# EasyEDA schematic 2 Schematic_HF Upconverter (TH).json

## Sheets
1 HF Upconverter (TH): Mixer with filters: TITLE: HF Upconverter (TH): Mixer with filters; REV: 3.5.EE; Date: 2018-03-05; Sheet: 3/3; Drawn By: IgrikXD
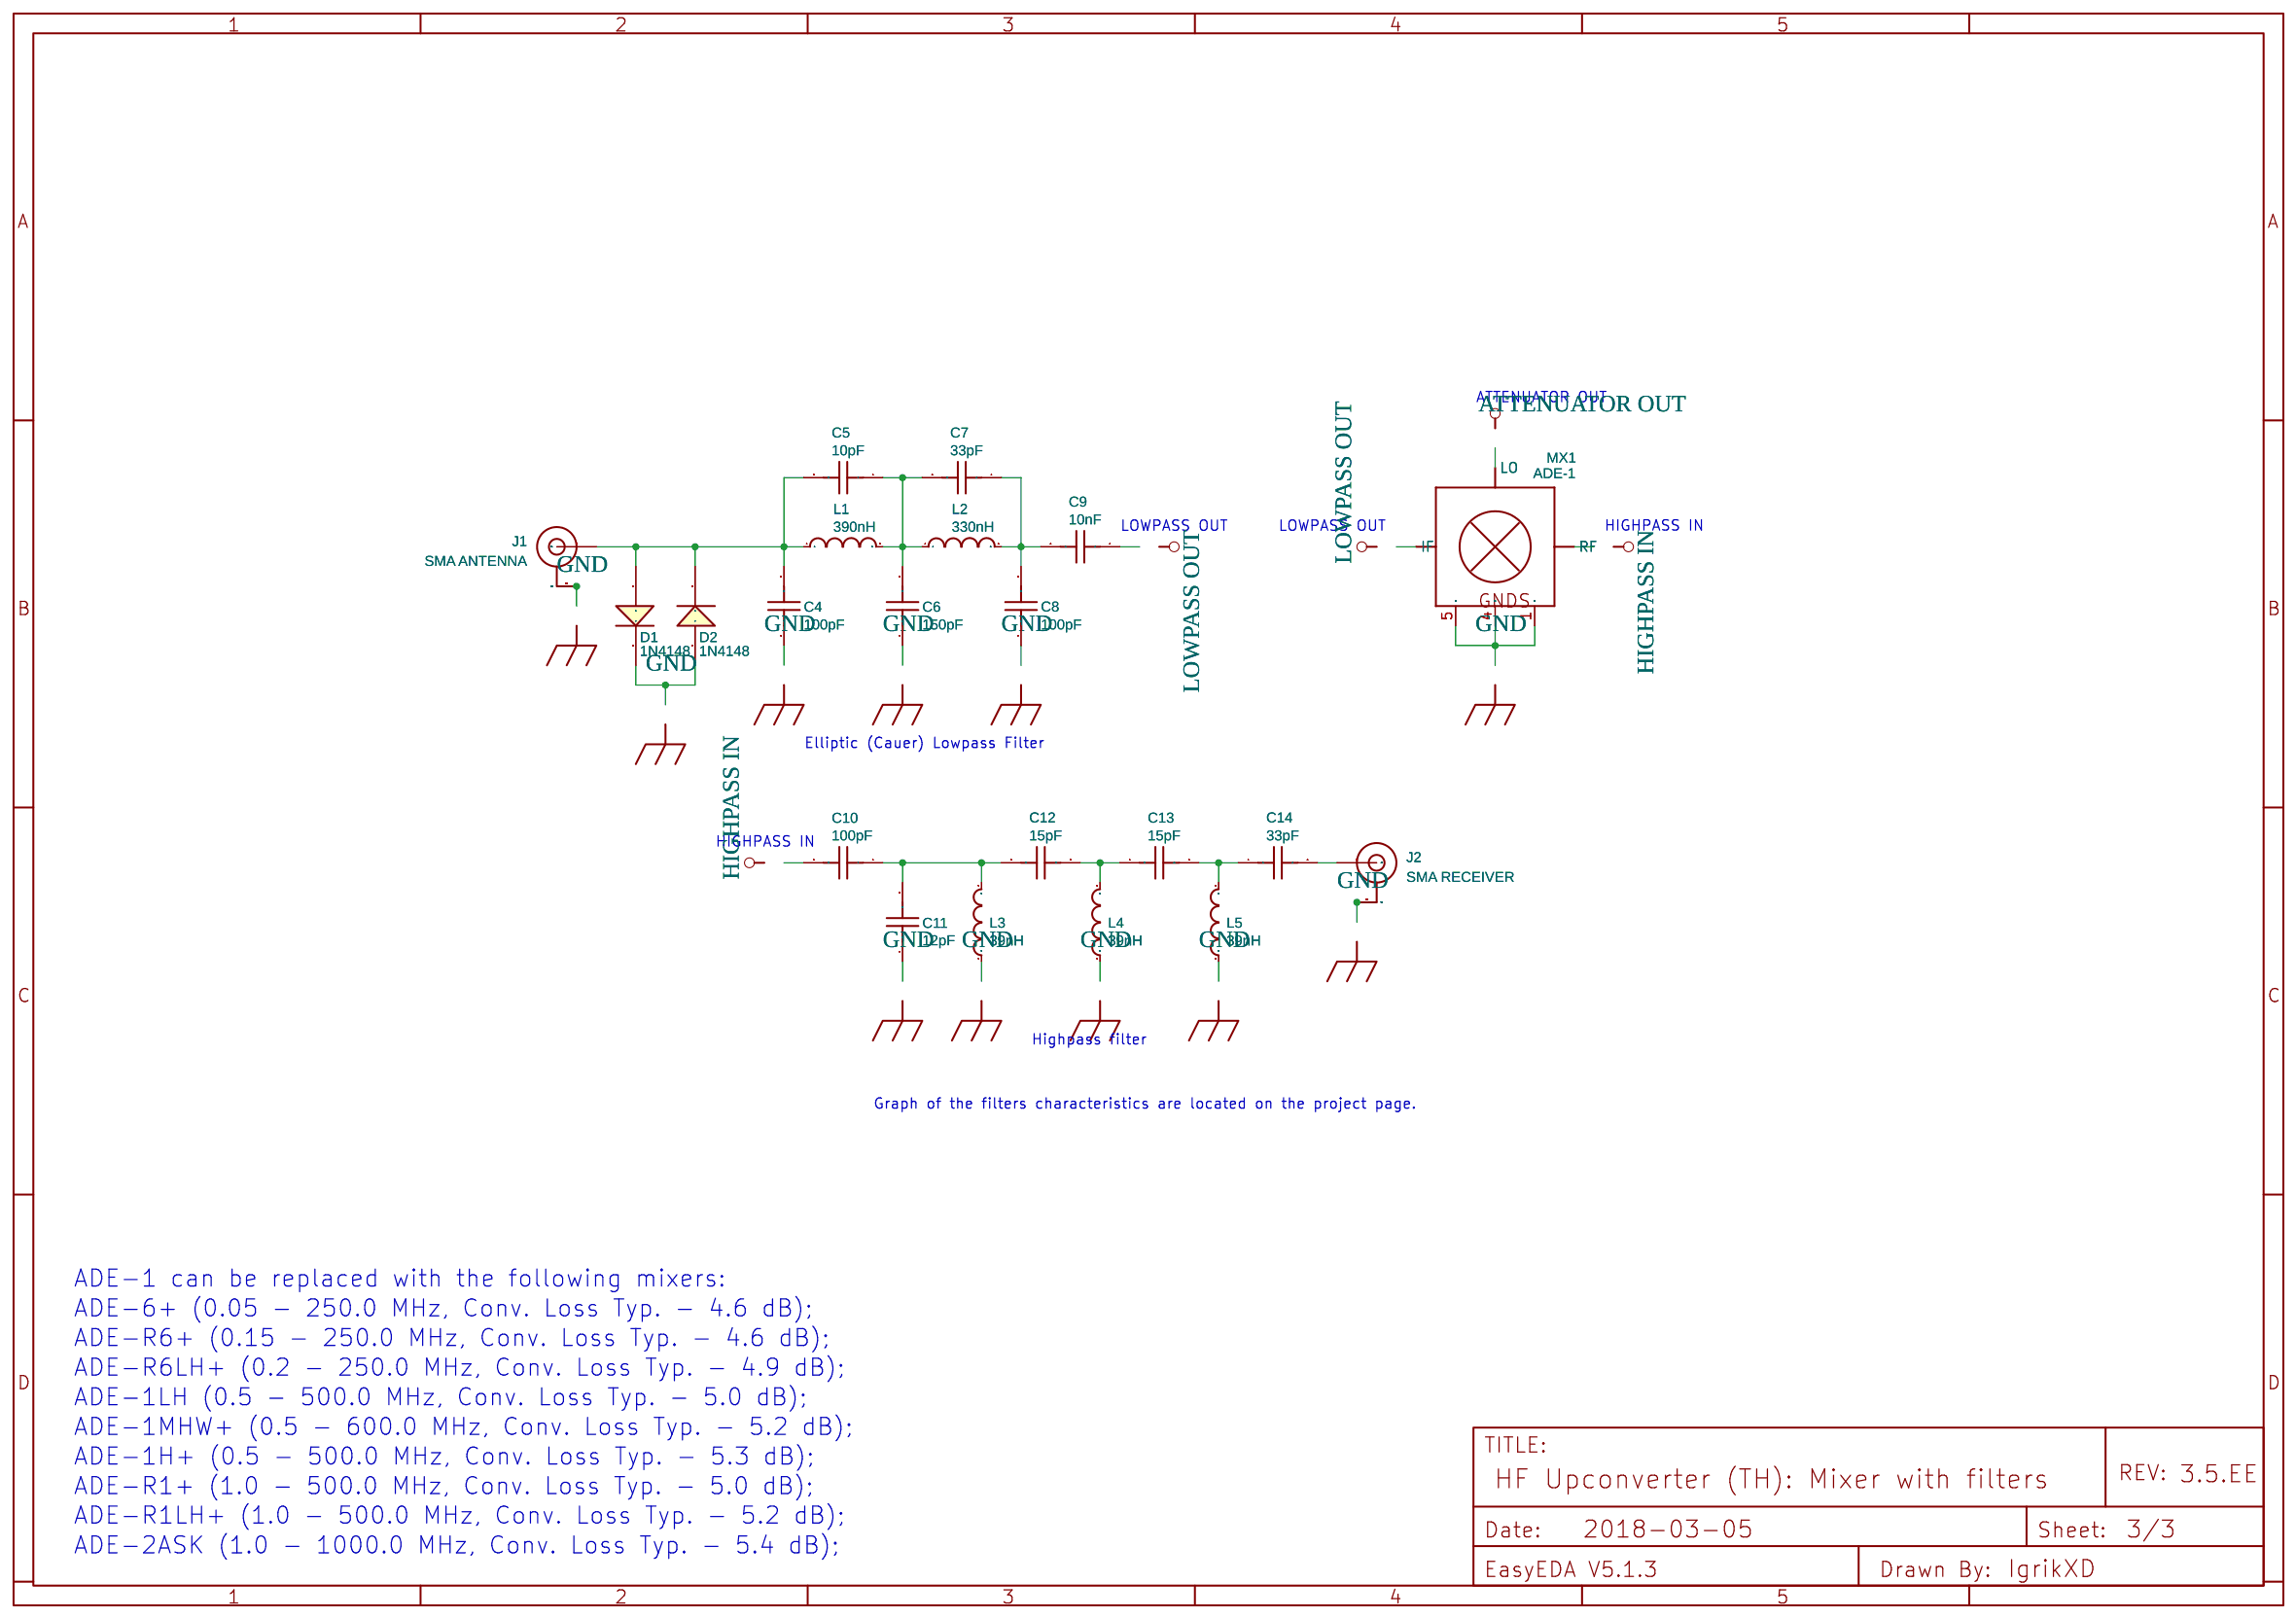
[diagram p0: HF Upconverter (TH): Mixer with filters]
2 HF Upconverter (TH): Power circuit: TITLE: HF Upconverter (TH): Power circuit; Sheet: 1/3
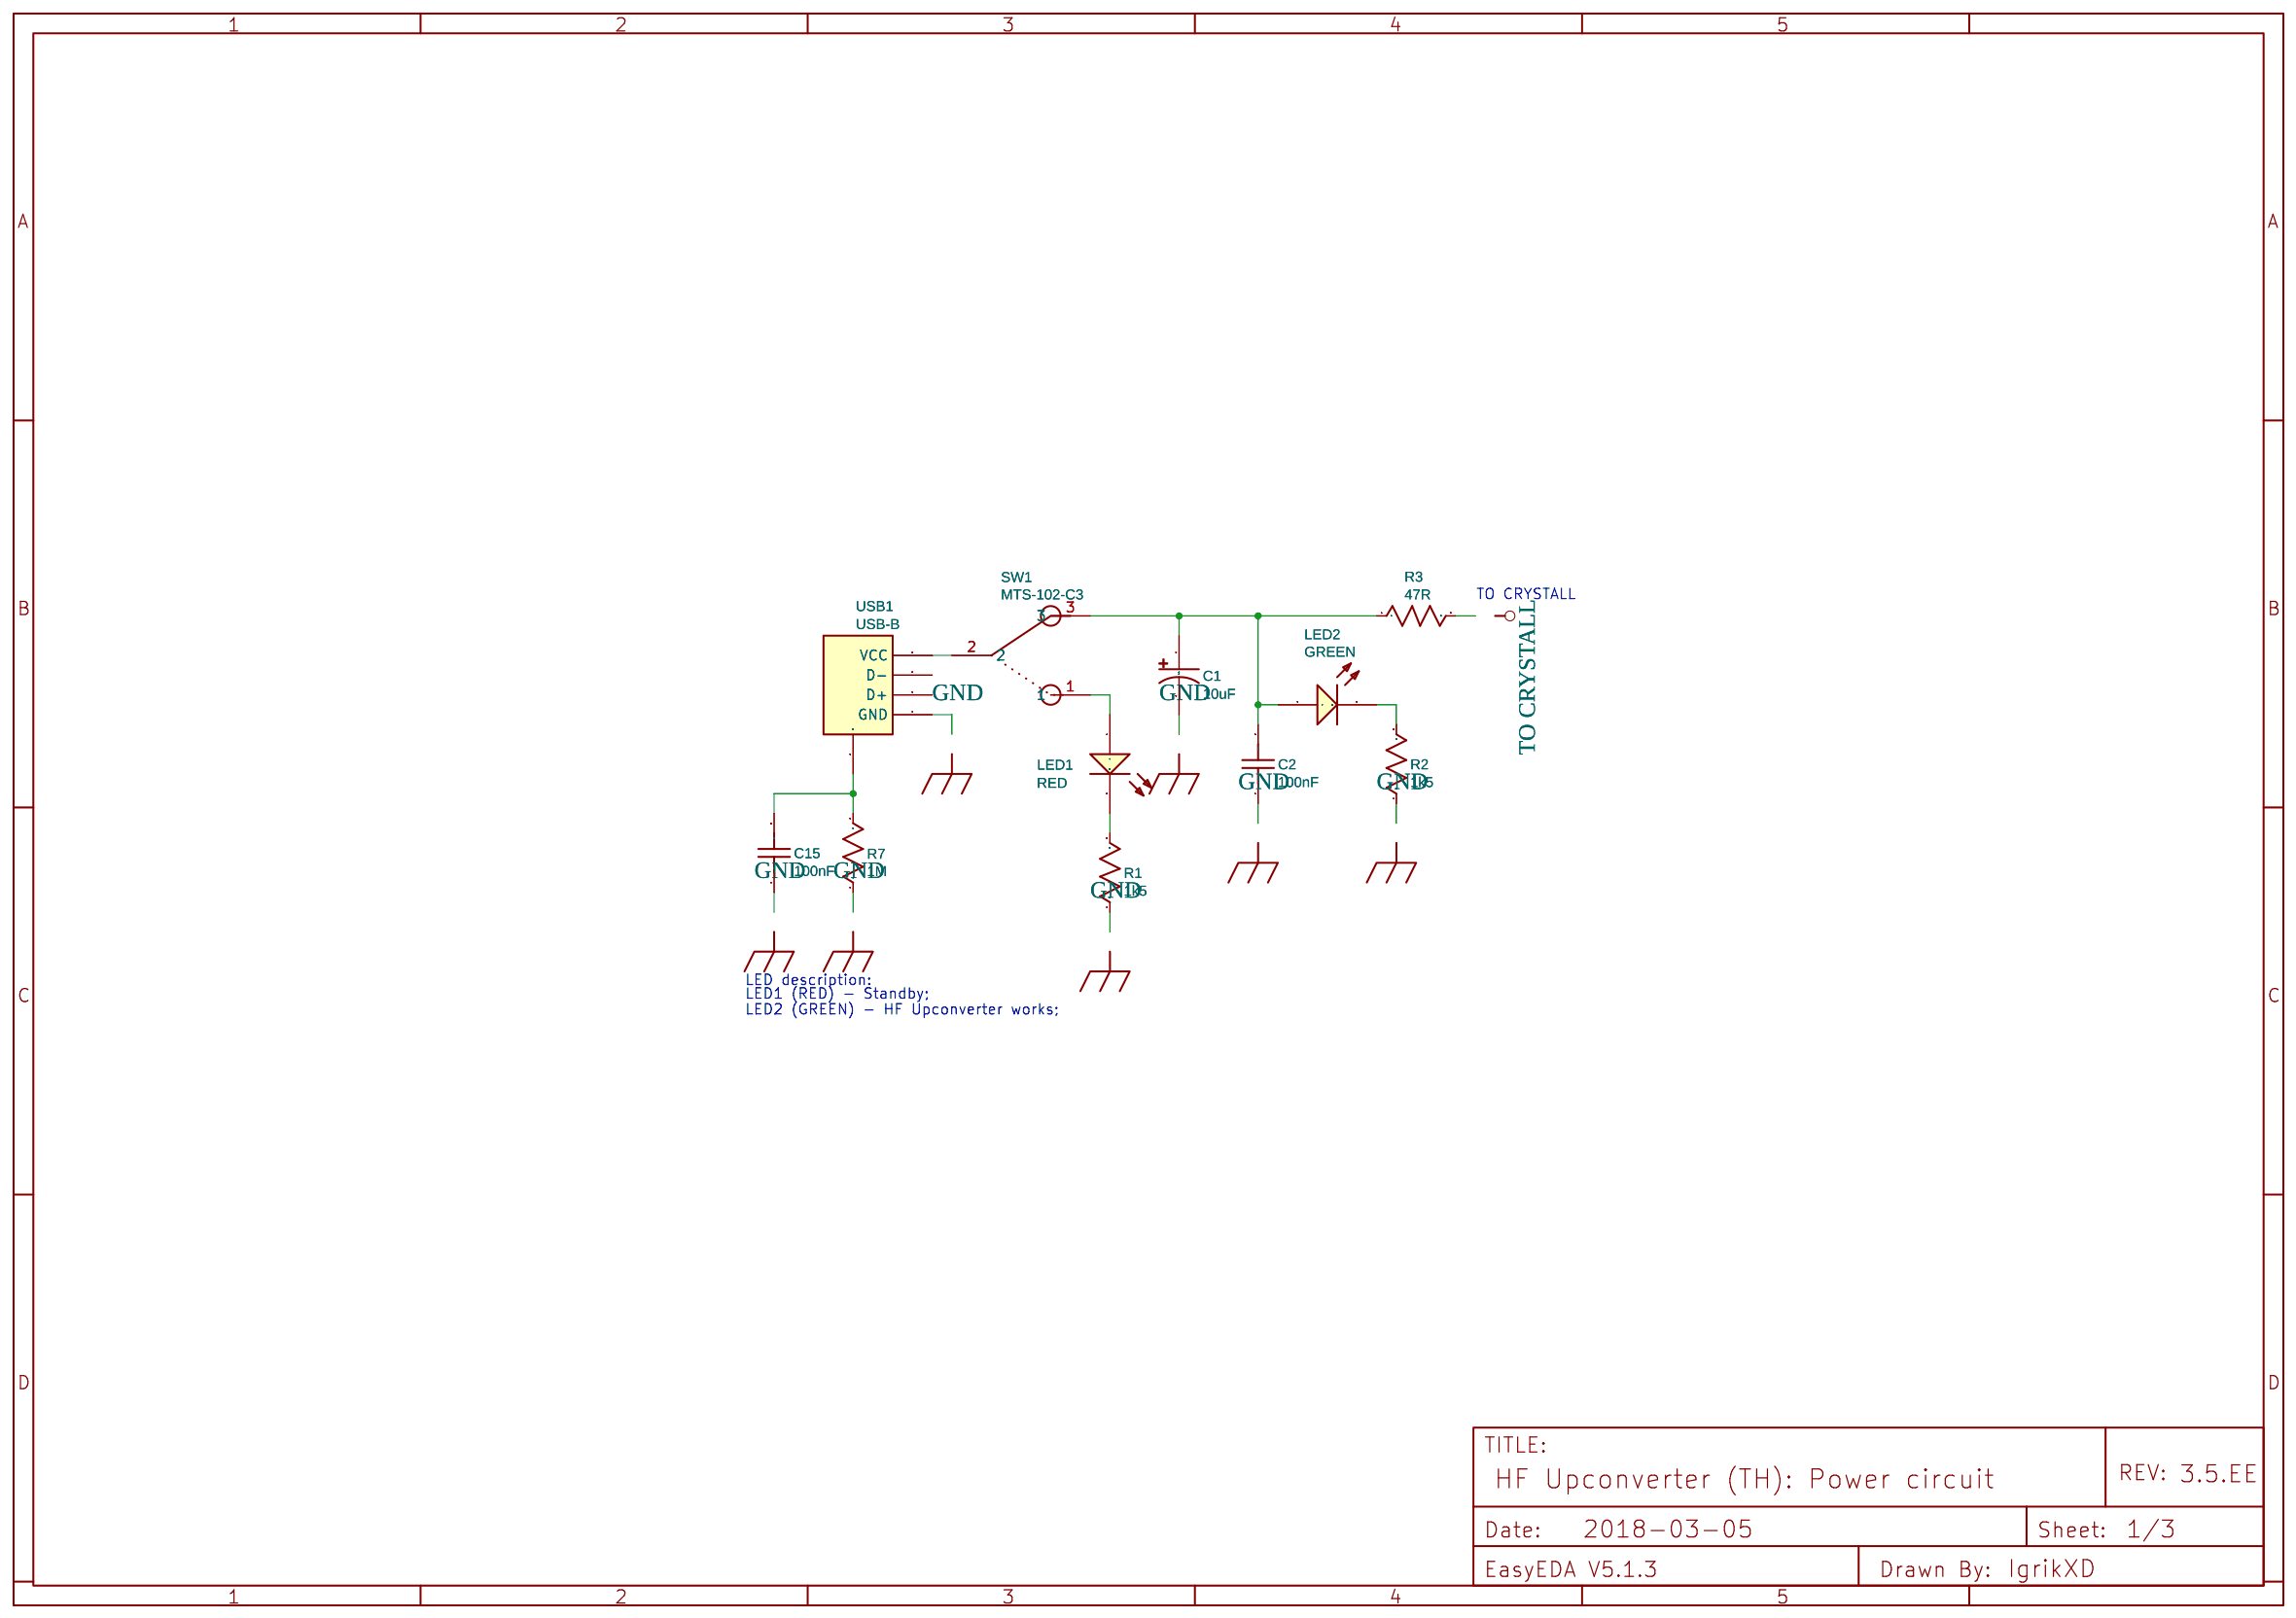
[diagram p1: HF Upconverter (TH): Power circuit]
3 HF Upconverter (TH): Crystal oscillator: TITLE: HF Upconverter (TH): Crystal oscillator; Sheet: 2/3
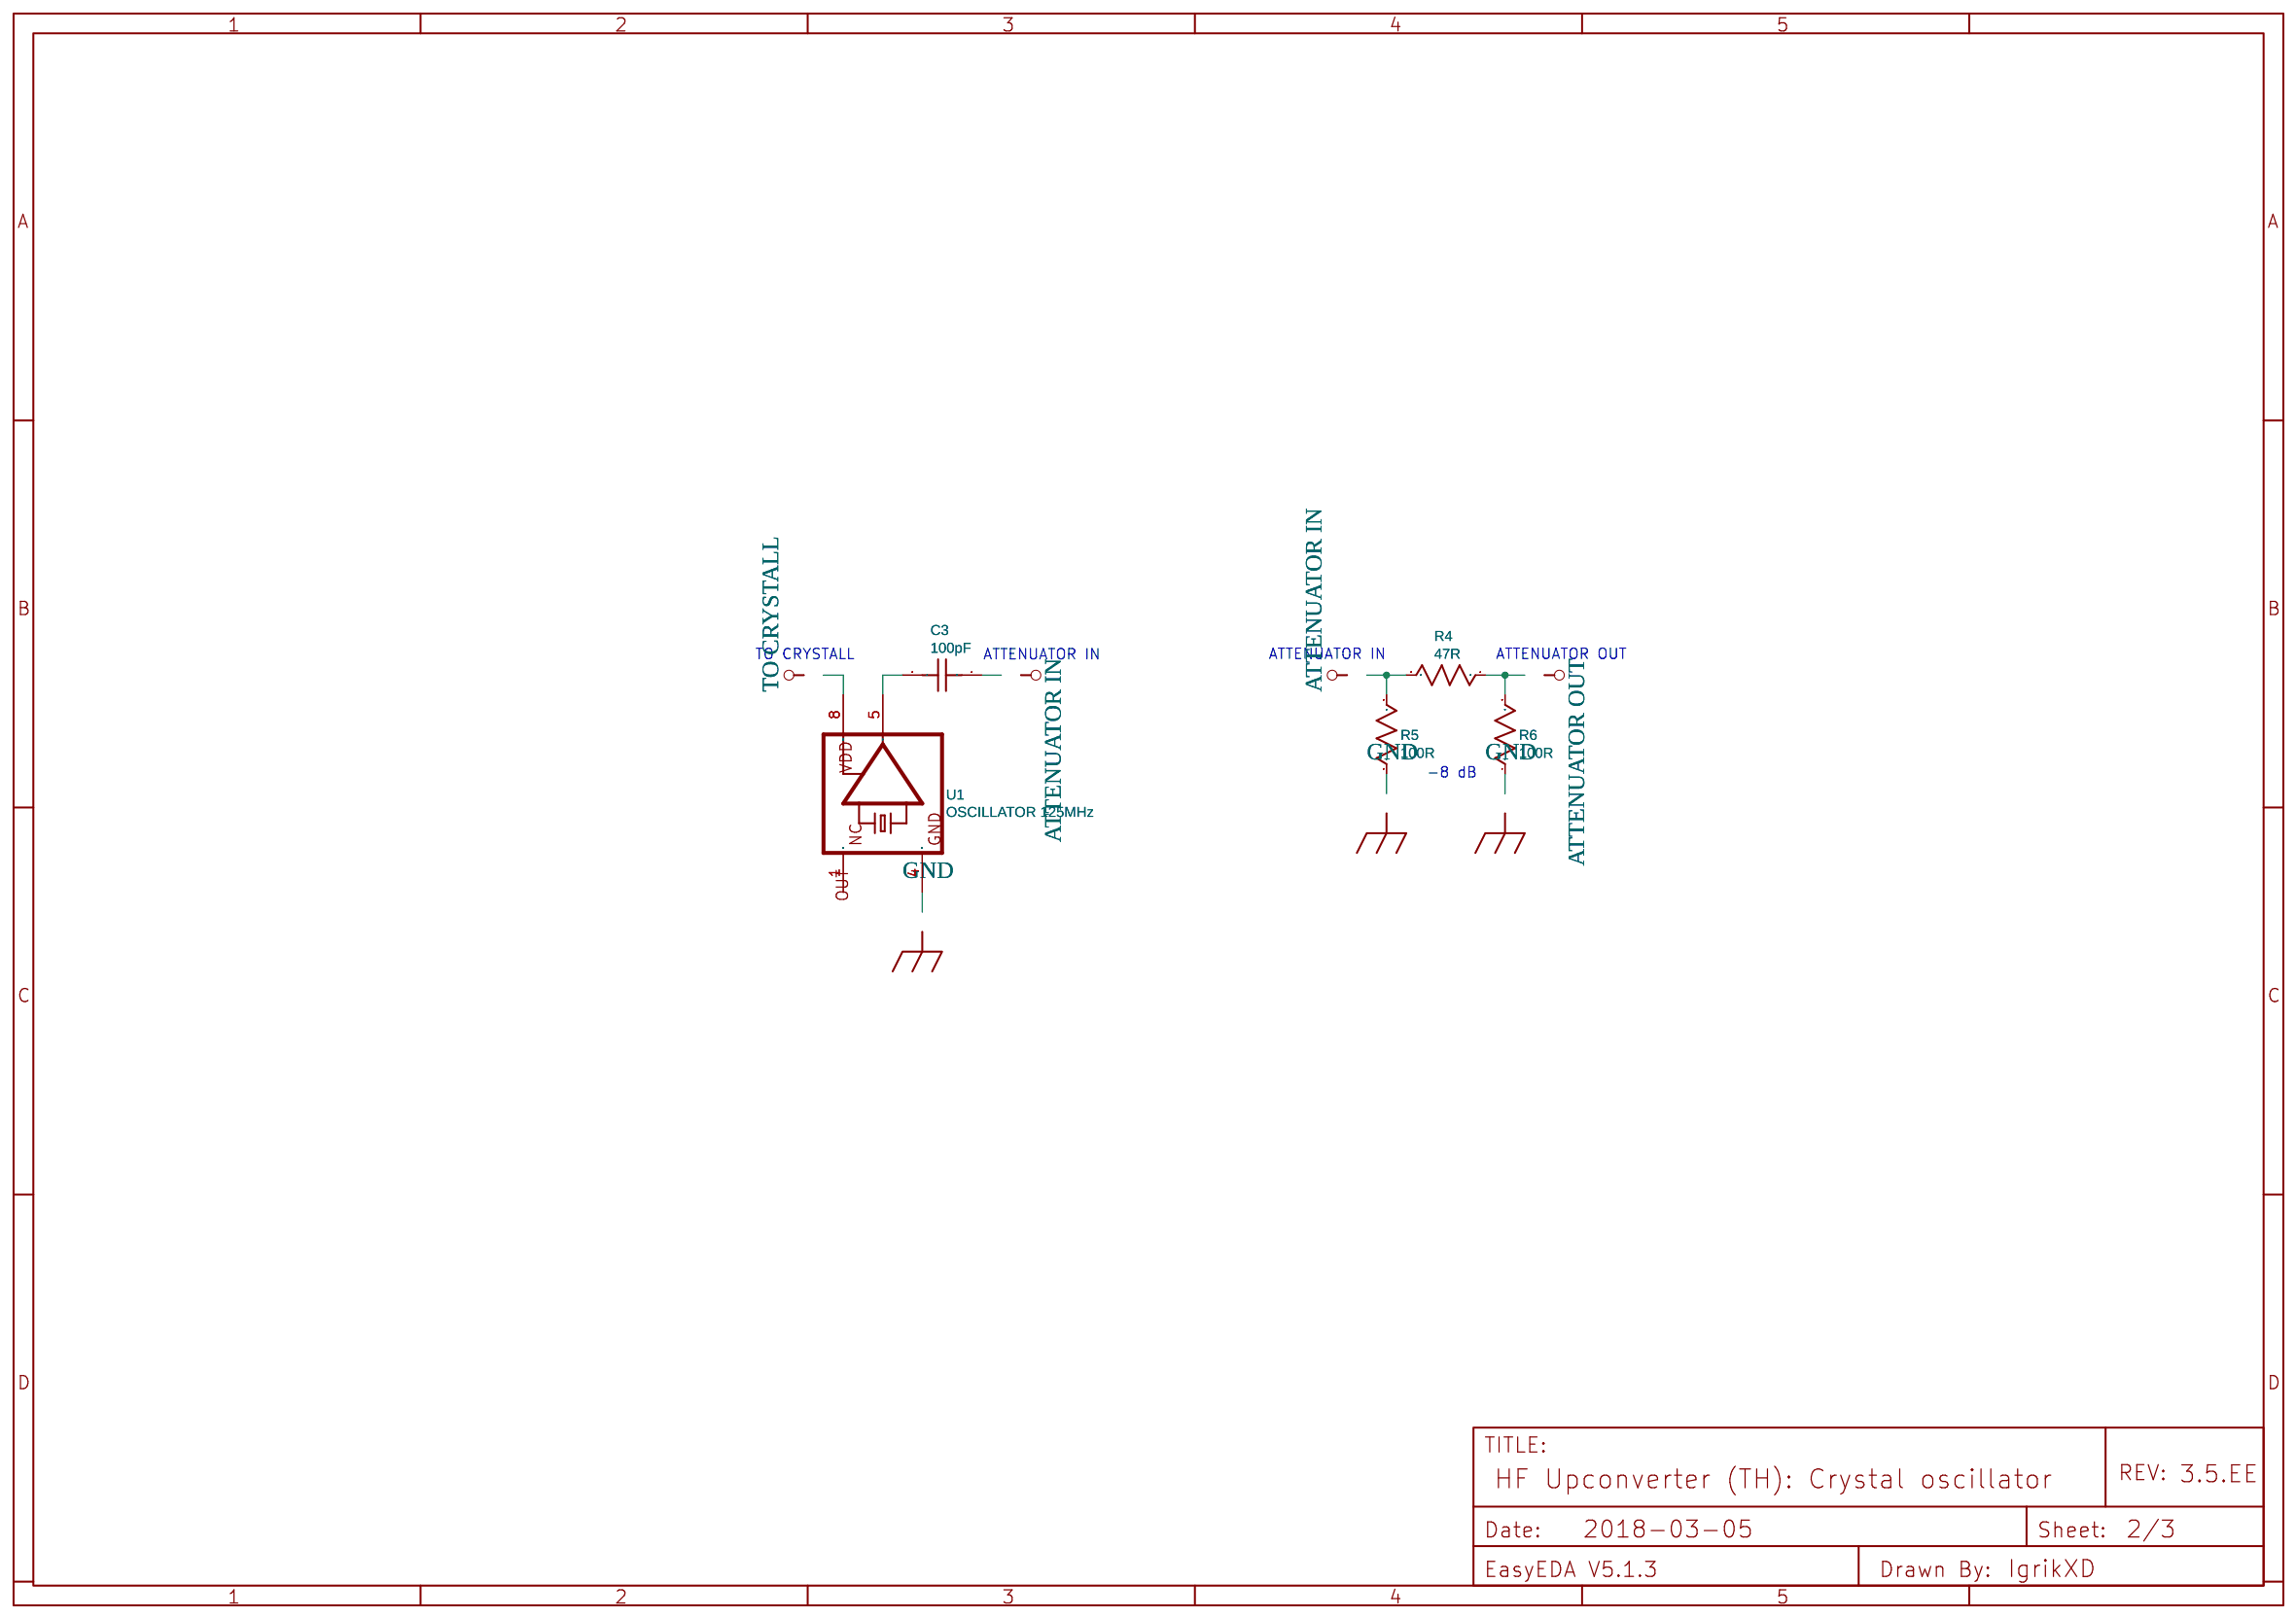
[diagram p2: HF Upconverter (TH): Crystal oscillator]

## Parts
sheet HF Upconverter (TH): Crystal oscillator
C3  100pF  [RAD-0.2]
R4  47R  [AXIAL-0.3]
R5  100R  [AXIAL-0.3]
R6  100R  [AXIAL-0.3]
U1  OSCILLATOR 125MHz  [CRYSTAL-OSCILLATOR]
sheet HF Upconverter (TH): Mixer with filters
C4  100pF  [RAD-0.2]
C5  10pF  [RAD-0.2]
C6  150pF  [RAD-0.2]
C7  33pF  [RAD-0.2]
C8  100pF  [RAD-0.2]
C9  10nF  [RAD-0.2]
C10  100pF  [RAD-0.2]
C11  12pF  [RAD-0.2]
C12  15pF  [RAD-0.2]
C13  15pF  [RAD-0.2]
C14  33pF  [RAD-0.2]
D1  1N4148  [DO-35]
D2  1N4148  [DO-35]
J1  SMA ANTENNA  [SMA-EDGE]
J2  SMA RECEIVER  [SMA-EDGE]
L1  390nH  [AXIAL-0.4]
L2  330nH  [AXIAL-0.4]
L3  39nH  [AXIAL-0.4]
L4  39nH  [AXIAL-0.4]
L5  39nH  [AXIAL-0.4]
MX1  ADE-1  [CD636]
sheet HF Upconverter (TH): Power circuit
C1  10uF  [CAP-D5.0XF2.0]
C2  100nF  [RAD-0.2]
C15  100nF  [RAD-0.2]
LED1  RED  [LED-3MM/2.54]
LED2  GREEN  [LED-3MM/2.54]
R1  1k5  [AXIAL-0.3]
R2  1k5  [AXIAL-0.3]
R3  47R  [AXIAL-0.3]
R7  1M  [AXIAL-0.3]
SW1  MTS-102-C3  [MTS-102-C3]
USB1  USB-B  [USB TYPE B]

## Library data of the parts
C3 C4 C8 C10 = Capacitor: Manufacturer Part: CC4-0805-CG -50V-100pF-J; Supplier: LCSC; LCSC: C123146; Manufacturer: TORCH
R3 R4 = Resistor: Manufacturer Part: MF1/4W-47Ω±1% T52; Supplier: LCSC; LCSC: C119296; Manufacturer: CCO
R5 R6 = Resistor: Manufacturer Part: MF1/4W-100Ω±1% T52; Supplier: LCSC; LCSC: C119304; Manufacturer: CCO
U1 = -: catid: 20; Manufacturer Part: CPPC4L-A7BR-125.0TS; Supplier: Digi-Key; Digi-Key: CPPC4L-A7BR-125.0TS-ND; Manufacturer: Cardinal Components Inc.
C5 = Capacitor: Manufacturer Part: CC4-0805-CG -50V-10pF-J; Supplier: LCSC; LCSC: C123155; Manufacturer: TORCH
C6 = Capacitor: Manufacturer Part: CC4-0805N151J500PF3; Supplier: LCSC; LCSC: C128041; Manufacturer: FH
C7 C14 = Capacitor: Manufacturer Part: CC4-0805N330J500F3; Supplier: LCSC; LCSC: C94712; Manufacturer: FH
C9 = Capacitor: Manufacturer Part: CT4-0805B103K500F3; Supplier: LCSC; LCSC: C94713; Manufacturer: FH
C11 = Capacitor: Supplier: LCSC
C12 C13 = Capacitor: Manufacturer Part: CC4-0805-CG -50V-15pF-J; Supplier: LCSC; LCSC: C123158; Manufacturer: TORCH
D1 D2 = -: LCSC: C85687; Supplier: LCSC; Manufacturer: MCC; Manufacturer Part: 1N4148-TP
J1 J2 = -: SMA Antenna Connector; catid: 20; Contributor: Pinoccio; Manufacturer Part: CON-SMA-EDGE-S; Supplier: Digi-Key; Digi-Key: CON-SMA-EDGE-S-ND; Manufacturer: RF Solutions
L1 = Inductor: Manufacturer Part: NOT DEFINED; Supplier: Handmade; Handmade: Wire Ø0.25mm., coil Ø2.5mm., windings 16
L2 = Inductor: Manufacturer Part: NOT DEFINED; Supplier: Handmade; Handmade: Wire Ø0.25mm., coil Ø2.5mm., windings 14
L3 L4 = Inductor: Manufacturer Part: NOT DEFINED; Supplier: Handmade; Handmade: Wire Ø0.5mm., coil Ø2.5mm., windings 4.
L5 = Inductor: Manufacturer Part: NOT DEFINED; Supplier: LCSC; LCSC: Wire Ø0.5mm., coil Ø2.5mm., windings 4.
MX1 = -: catid: 20; Manufacturer Part: NOT DEFINED; Supplier: Mini-Circuits; Mini-Circuits: ADE-1+; Manufacturer: Mini Circuits
C1 = Capacitor: Manufacturer Part: 10uF 16V 3*5; Supplier: LCSC; LCSC: C43798; Manufacturer: LCSC
C2 C15 = Capacitor: Manufacturer Part: Monolithic0805B104J500F3; Supplier: LCSC; LCSC: C110282; Manufacturer: FH
LED1 = -: LCSC: C2155; Supplier: LCSC; Manufacturer: KENTO; Manufacturer Part: 3AR4PD08
LED2 = -: LCSC: C17233; Supplier: LCSC; Manufacturer: KENTO; Manufacturer Part: 3CG4HD01
R1 R2 = Resistor: Manufacturer Part: MF1/4W-1.5KΩ±1% T52; Supplier: LCSC; LCSC: C119328; Manufacturer: CCO
R7 = Resistor: Manufacturer Part: MFR0W4F1004A50; Supplier: LCSC; LCSC: C58596; Manufacturer: UniOhm
SW1 = -: Contributor: snhunter; sourceId: LjTecMmIi
USB1 = -: Supplier: LCSC; Manufacturer: LCSC; Manufacturer Part: USB BFemale90 White plastic; LCSC: C46393

## Nets
GND: C1.2 C2.1 C4.1 C6.1 C8.1 C11.1 C15.1 D1.2(K) D2.1(A) J1.GND@0(GND) J1.GND@1(GND) J1.GND@2(GND) J1.GND@3(GND) J2.GND@0(GND) J2.GND@1(GND) J2.GND@2(GND) J2.GND@3(GND) L3.1 L4.1 L5.1 MX1.1(GND) MX1.4(GND) MX1.5(GND) R1.1 R2.1 R5.1 R6.1 R7.1 U1.4(VSS) USB1.4(GND)
ATTENUATOR IN: C3.1 R4.2 R5.2
ATTENUATOR OUT: MX1.6(LO) R4.1 R6.2
HIGHPASS IN: C10.2 MX1.3(RF)
LOWPASS OUT: C9.1 MX1.2(IF)
TO CRYSTALL: R3.2 U1.8(CON)
Net-(C1-1): C1.1 C2.2 LED2.1(A) R3.1 SW1.3
Net-(C3-2): C3.2 U1.5(OUT)
Net-(C4-2): C4.2 C5.2 D1.1(A) D2.2(K) J1.SIG(SIGNAL) L1.1
Net-(C5-1): C5.1 C6.2 C7.2 L1.2 L2.1
Net-(C7-1): C7.1 C8.2 C9.2 L2.2
Net-(C10-1): C10.1 C11.2 C12.1 L3.2
Net-(C12-2): C12.2 C13.1 L4.2
Net-(C13-2): C13.2 C14.1 L5.2
Net-(C14-2): C14.2 J2.SIG(SIGNAL)
Net-(C15-2): C15.2 R7.2 USB1.5(CASE)
Net-(LED1-1): LED1.1(A) SW1.1
Net-(LED1-2): LED1.2(C) R1.2
Net-(LED2-2): LED2.2(C) R2.2
Net-(SW1-2): SW1.2 USB1.1(VCC)

Not connected (* = marked no-connect by the designer): U1 1(VDD); USB1 2(D-) 3(D+)

## Notes on the sheets
sheet 1
- ATTENUATOR OUT
- LOWPASS OUT
- LOWPASS OUT
- HIGHPASS IN
- Elliptic (Cauer) Lowpass Filter
- HIGHPASS IN
- Highpass filter
- Graph of the filters characteristics are located on the project page.
- ADE-1 can be replaced with the following mixers:
- ADE-6+ (0.05 - 250.0 MHz, Conv. Loss Typ. - 4.6 dB);
- ADE-R6+ (0.15 - 250.0 MHz, Conv. Loss Typ. - 4.6 dB);
- ADE-R6LH+ (0.2 - 250.0 MHz, Conv. Loss Typ. - 4.9 dB);
- ADE-1LH (0.5 - 500.0 MHz, Conv. Loss Typ. - 5.0 dB);
- ADE-1MHW+ (0.5 - 600.0 MHz, Conv. Loss Typ. - 5.2 dB);
- ADE-1H+ (0.5 - 500.0 MHz, Conv. Loss Typ. - 5.3 dB);
- ADE-R1+ (1.0 - 500.0 MHz, Conv. Loss Typ. - 5.0 dB);
- ADE-R1LH+ (1.0 - 500.0 MHz, Conv. Loss Typ. - 5.2 dB);
- ADE-2ASK (1.0 - 1000.0 MHz, Conv. Loss Typ. - 5.4 dB);
sheet 2
- TO CRYSTALL
- LED description:
- LED1 (RED) - Standby;
- LED2 (GREEN) - HF Upconverter works;
sheet 3
- TO CRYSTALL
- ATTENUATOR IN
- ATTENUATOR IN
- ATTENUATOR OUT
- -8 dB
